# EAGLE design 16bit_Wing_Template (EAGLE 5.06)
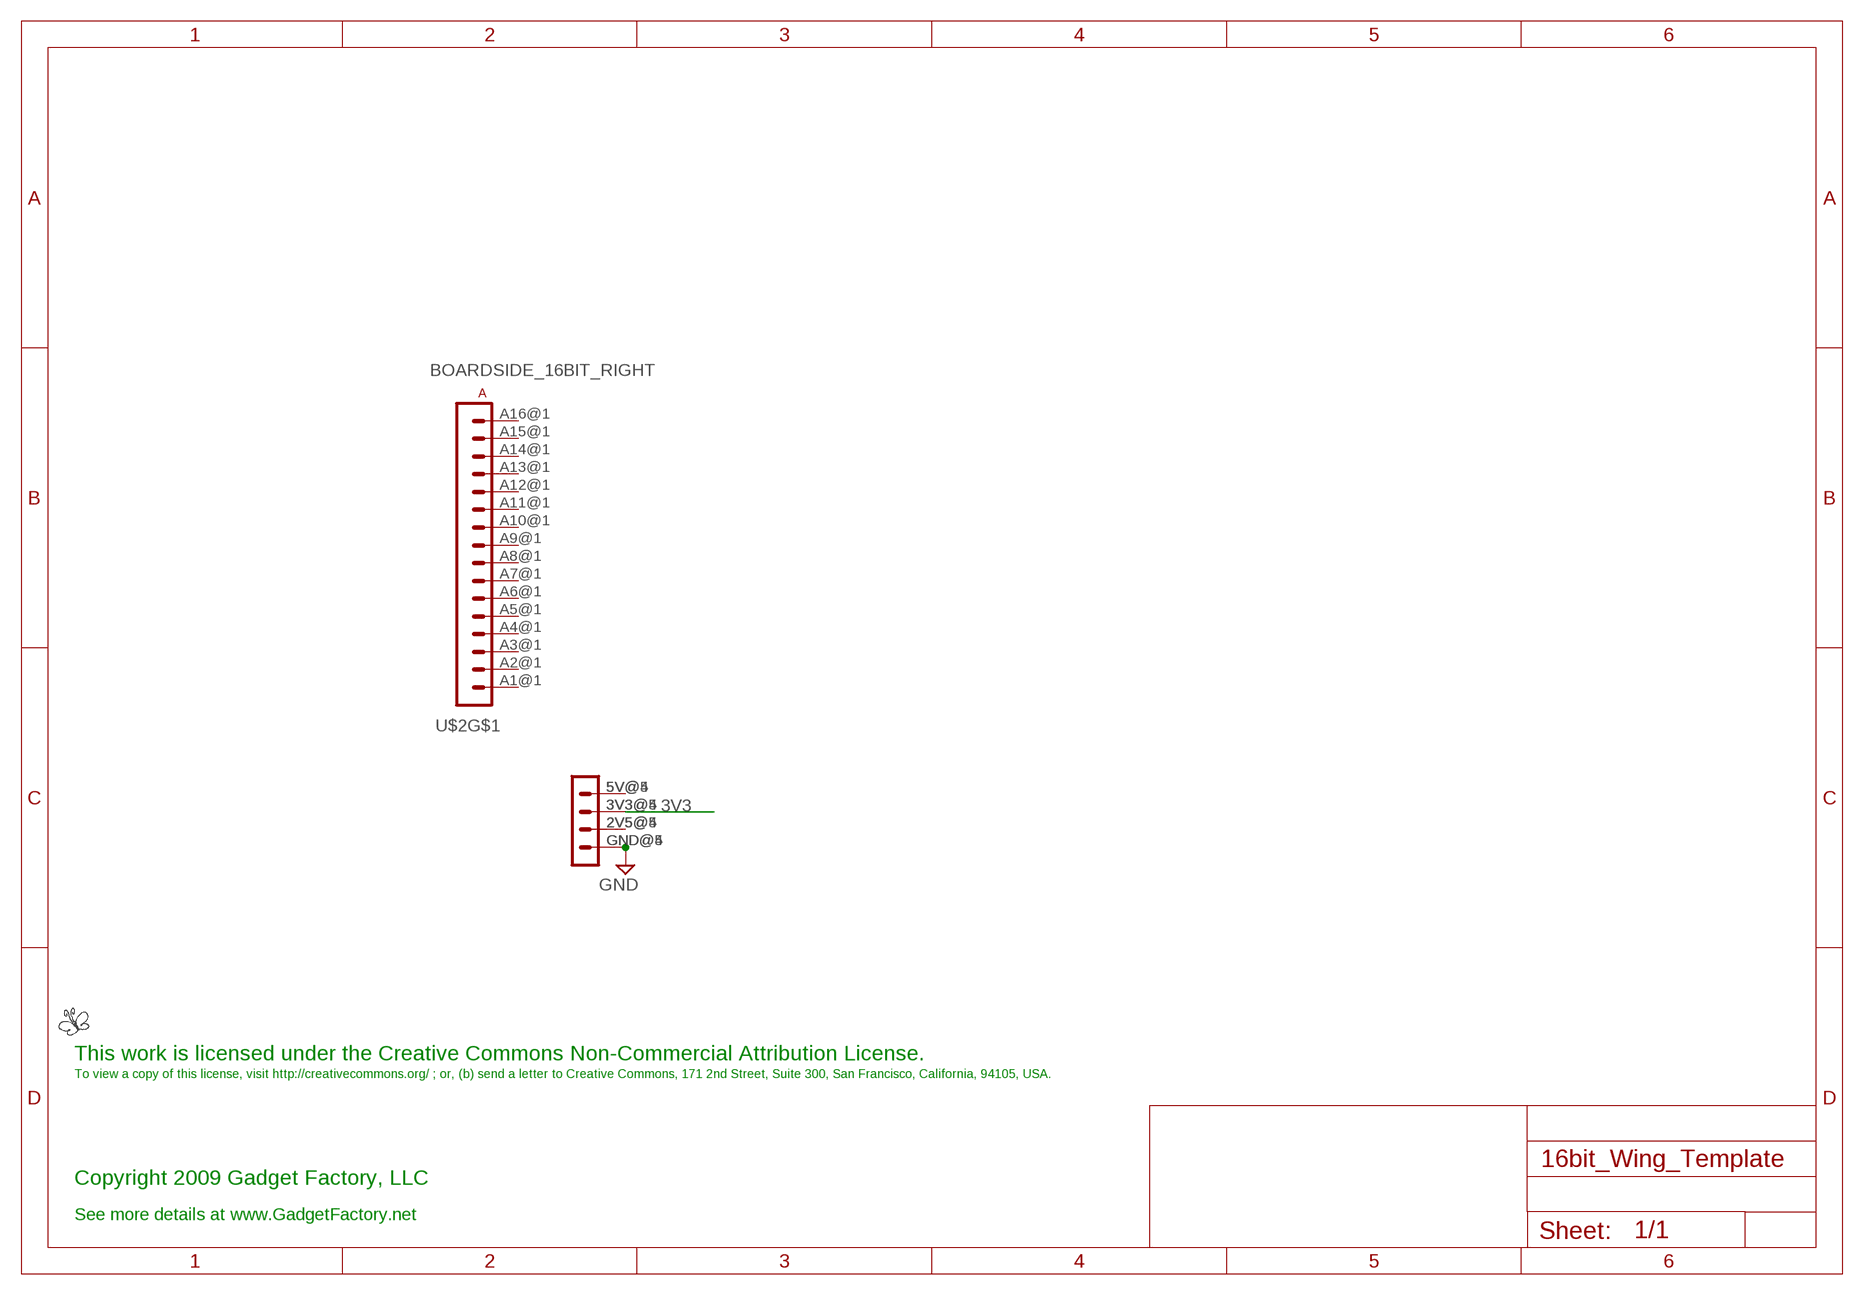
[diagram p0: schematic, sheet 1]

## Parts
LOGO1  BUTTERFLY_LOGO  [BUTTERFLY_LOGO]
U$2  BOARDSIDE_16BIT_RIGHT  [BOARDSIDE_16BIT_RIGHT]

## Nets
3V3: U$2.3V3@4(3V3) U$2.3V3@5(3V3)
GND: U$2.GND@4(GND) U$2.GND@5(GND)
N$1: U$2.5V@4(5V) U$2.5V@5(5V)
N$3: U$2.2V5@4(2V5) U$2.2V5@5(2V5)
Unconnected: U$2.A1@1(A1) U$2.A2@1(A2) U$2.A3@1(A3) U$2.A4@1(A4) U$2.A5@1(A5) U$2.A6@1(A6) U$2.A7@1(A7) U$2.A8@1(A8) U$2.A9@1(A9) U$2.A10@1(A10) U$2.A11@1(A11) U$2.A12@1(A12) U$2.A13@1(A13) U$2.A14@1(A14) U$2.A15@1(A15) U$2.A16@1(A16)

## Notes on the sheet
- This work is licensed under the Creative Commons Non-Commercial Attribution License.
- To view a copy of this license, visit http://creativecommons.org/ ; or, (b) send a letter to Creative Commons, 171 2nd Street, Suite 300, San Francisco, California, 94105, USA.
- Copyright 2009 Gadget Factory, LLC
- See more details at www.GadgetFactory.net

## Library data of the parts
LOGO1 = GadgetFactory_Pub:BUTTERFLY_LOGO
U$2 = GadgetFactory_Pub:BOARDSIDE_16BIT_RIGHT

## Board
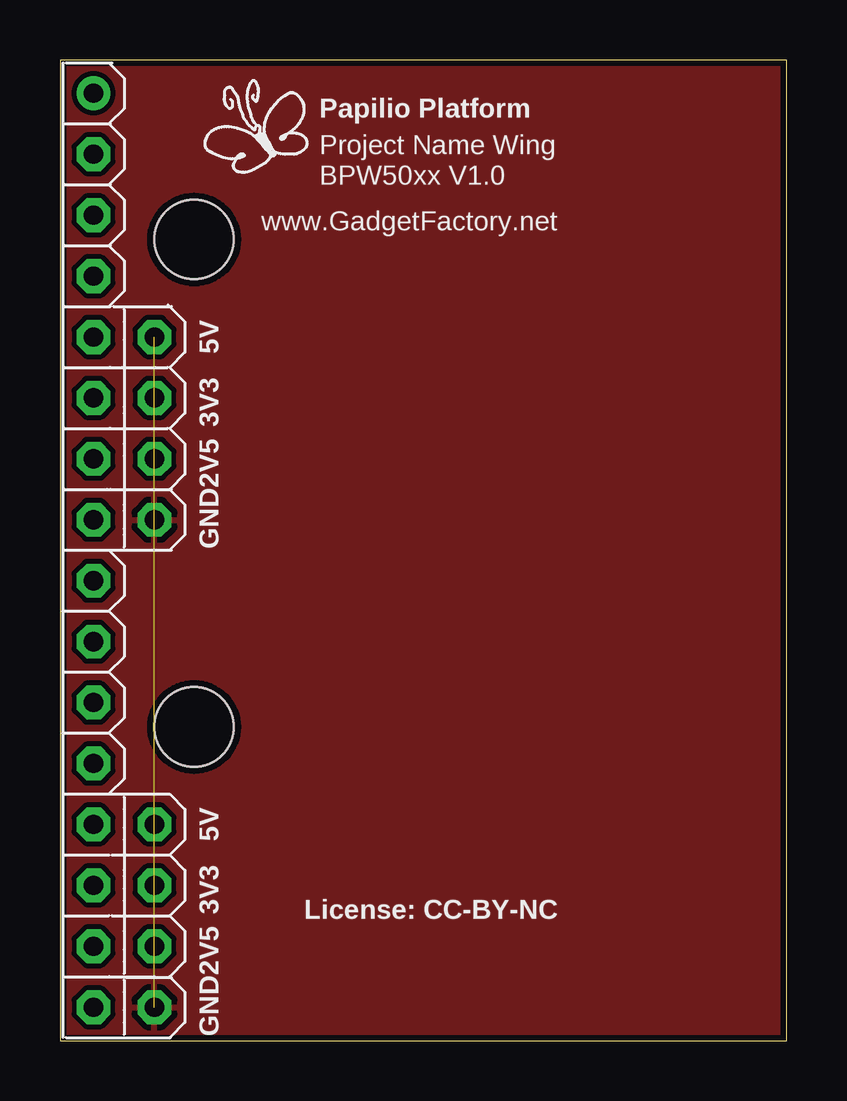
[diagram p1: board, top side]
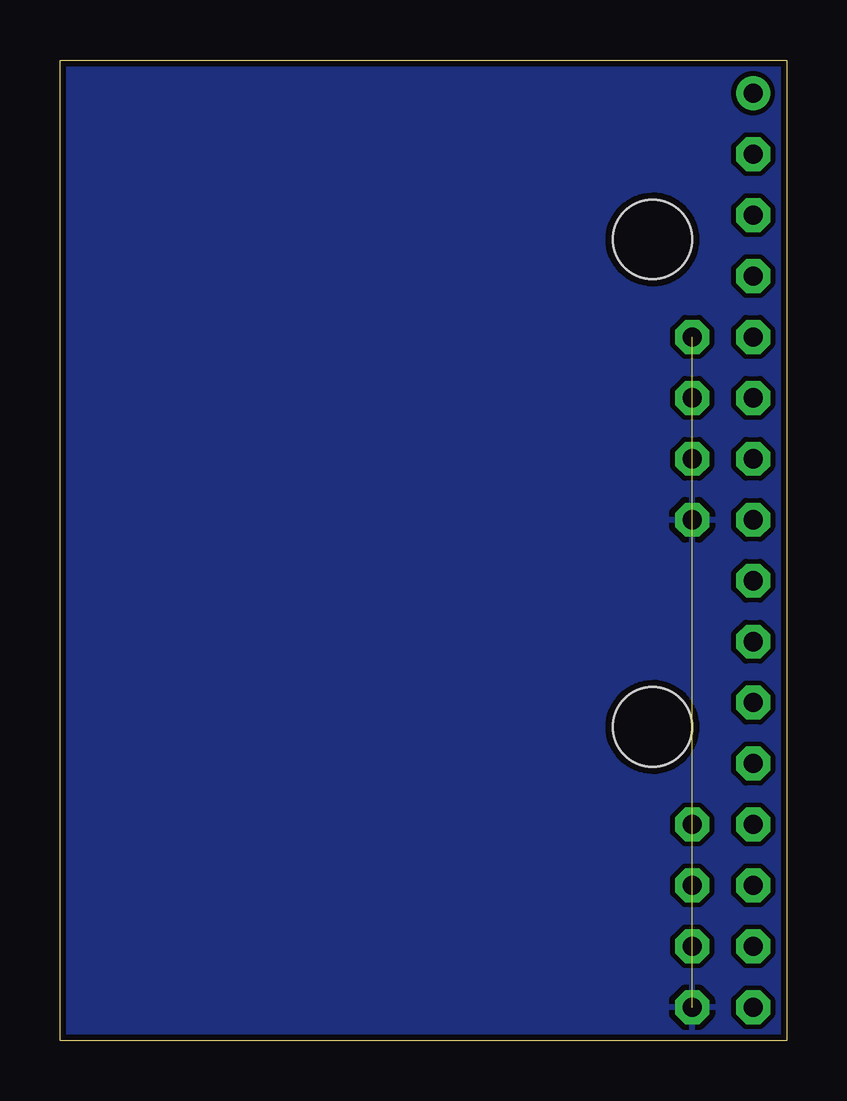
[diagram p2: board, bottom side, seen from below]

Size 30.28 x 40.88 mm. Coordinates in mm from the lower left corner, seen from the top.
Outline: 0,0 30.28,0 30.28,40.88 0,40.88 0,0
Copper layers (1*16): Top 0.035mm / dielectric 1.5mm / Bottom 0.035mm
Design rules "SparkFun_Derived_GoldePheonix_7mil": minimum track width 7mil, minimum drill 15mil, track to track 8mil, track to pad 8mil, pad to pad 8mil, via to via 8mil, smd to smd 8mil, copper to edge 10mil, drill to drill 8mil, minimum pad ring 12mil, minimum via ring 10mil, stop-mask expansion 4mil, vias tented up to drill 18mil, thermal gap 10mil

### Footprints (pad centres in the part's own frame; a part is rotated, then mirrored left to right if it is on the bottom)
BOARDSIDE_16BIT_RIGHT = drill 0.8 octagon: 2V5@4 3.81,-16.51; 2V5@5 3.81,3.81; 3V3@4 3.81,-13.97; 3V3@5 3.81,6.35; 5V@4 3.81,-11.43; 5V@5 3.81,8.89; A1@1 1.27,-19.05; A2@1 1.27,-16.51; A3@1 1.27,-13.97; A4@1 1.27,-11.43; A5@1 1.27,-8.89; A6@1 1.27,-6.35; A7@1 1.27,-3.81; A8@1 1.27,-1.27; A9@1 1.27,1.27; A10@1 1.27,3.81; A11@1 1.27,6.35; A12@1 1.27,8.89; A13@1 1.27,11.43; A14@1 1.27,13.97; A15@1 1.27,16.51; GND@4 3.81,-19.05; GND@5 3.81,1.27 | drill 0.8 round: A16@1 1.27,19.05 | hole 3.302: 5.461,12.954; 5.461,-7.366

### Placement (x,y rotation side)
LOGO1  8.26,37.59 0 top
U$2  0.13,20.45 0 top

### Tracks (layer width: path | path; a pad name or v marks a point on that pad's centre or on a via)
3V3  (1 unrouted)
GND  (1 unrouted)
  pour Top: 0.13,40.77 30.1,40.77 30.1,0.13 0.13,0.13
  pour Bottom: 0.13,40.77 30.1,40.77 30.1,0.13 0.13,0.13
N$1  (1 unrouted)
N$3  (1 unrouted)

### Text on the board
tPlace: Papilio Platform | Project Name Wing | BPW50xx V1.0 | www.GadgetFactory.net | License: CC-BY-NC